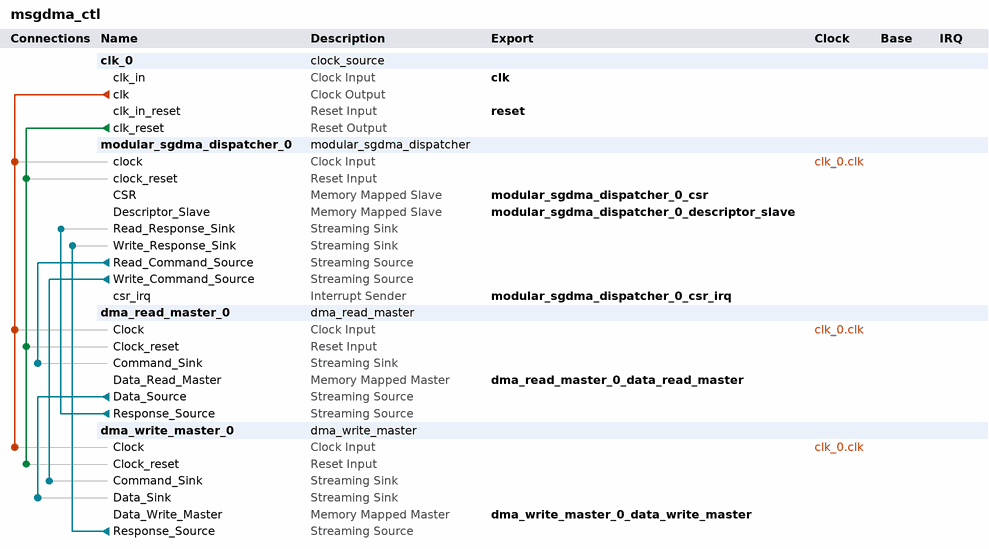
[diagram p0: system contents]
# Platform Designer (Qsys) system msgdma_ctl, Cyclone V 5CGXFC9D6F27C7
# Parameters at their usual value, and those the tool derives, are not listed.
package require -exact qsys 18.1
create_system msgdma_ctl
set_project_property DEVICE_FAMILY {Cyclone V}
set_project_property DEVICE 5CGXFC9D6F27C7

add_instance clk_0 clock_source 18.1
set_instance_parameter_value clk_0 clockFrequency 250000000

add_instance modular_sgdma_dispatcher_0 modular_sgdma_dispatcher 18.1
set_instance_parameter_value modular_sgdma_dispatcher_0 BURST_ENABLE 0
set_instance_parameter_value modular_sgdma_dispatcher_0 BURST_WRAPPING_SUPPORT 0
set_instance_parameter_value modular_sgdma_dispatcher_0 CSR_ADDRESS_WIDTH 3
set_instance_parameter_value modular_sgdma_dispatcher_0 DATA_FIFO_DEPTH 32
set_instance_parameter_value modular_sgdma_dispatcher_0 DATA_WIDTH 32
set_instance_parameter_value modular_sgdma_dispatcher_0 DESCRIPTOR_FIFO_DEPTH 64
set_instance_parameter_value modular_sgdma_dispatcher_0 ENHANCED_FEATURES 0
set_instance_parameter_value modular_sgdma_dispatcher_0 GUI_RESPONSE_PORT 2
set_instance_parameter_value modular_sgdma_dispatcher_0 MAX_BURST_COUNT 2
set_instance_parameter_value modular_sgdma_dispatcher_0 MAX_BYTE 1024
set_instance_parameter_value modular_sgdma_dispatcher_0 MAX_STRIDE 1
set_instance_parameter_value modular_sgdma_dispatcher_0 MODE 0
set_instance_parameter_value modular_sgdma_dispatcher_0 PREFETCHER_USE_CASE 0
set_instance_parameter_value modular_sgdma_dispatcher_0 PROGRAMMABLE_BURST_ENABLE 0
set_instance_parameter_value modular_sgdma_dispatcher_0 STRIDE_ENABLE 0
set_instance_parameter_value modular_sgdma_dispatcher_0 TRANSFER_TYPE {Aligned Accesses}

add_instance dma_read_master_0 dma_read_master 18.1
set_instance_parameter_value dma_read_master_0 BURST_ENABLE 1
set_instance_parameter_value dma_read_master_0 CHANNEL_ENABLE 0
set_instance_parameter_value dma_read_master_0 CHANNEL_WIDTH 8
set_instance_parameter_value dma_read_master_0 DATA_WIDTH 128
set_instance_parameter_value dma_read_master_0 ERROR_ENABLE 0
set_instance_parameter_value dma_read_master_0 ERROR_WIDTH 8
set_instance_parameter_value dma_read_master_0 FIFO_DEPTH 256
set_instance_parameter_value dma_read_master_0 FIFO_SPEED_OPTIMIZATION 1
set_instance_parameter_value dma_read_master_0 FIX_ADDRESS_WIDTH 32
set_instance_parameter_value dma_read_master_0 GUI_BURST_WRAPPING_SUPPORT 0
set_instance_parameter_value dma_read_master_0 GUI_MAX_BURST_COUNT 64
set_instance_parameter_value dma_read_master_0 GUI_PROGRAMMABLE_BURST_ENABLE 0
set_instance_parameter_value dma_read_master_0 GUI_STRIDE_WIDTH 1
set_instance_parameter_value dma_read_master_0 LENGTH_WIDTH 19
set_instance_parameter_value dma_read_master_0 PACKET_ENABLE 0
set_instance_parameter_value dma_read_master_0 STRIDE_ENABLE 0
set_instance_parameter_value dma_read_master_0 TRANSFER_TYPE {Full Word Accesses Only}
set_instance_parameter_value dma_read_master_0 USE_FIX_ADDRESS_WIDTH 0

add_instance dma_write_master_0 dma_write_master 18.1
set_instance_parameter_value dma_write_master_0 BURST_ENABLE 1
set_instance_parameter_value dma_write_master_0 DATA_WIDTH 128
set_instance_parameter_value dma_write_master_0 ERROR_ENABLE 0
set_instance_parameter_value dma_write_master_0 ERROR_WIDTH 8
set_instance_parameter_value dma_write_master_0 FIFO_DEPTH 512
set_instance_parameter_value dma_write_master_0 FIFO_SPEED_OPTIMIZATION 1
set_instance_parameter_value dma_write_master_0 FIX_ADDRESS_WIDTH 32
set_instance_parameter_value dma_write_master_0 GUI_BURST_WRAPPING_SUPPORT 0
set_instance_parameter_value dma_write_master_0 GUI_MAX_BURST_COUNT 128
set_instance_parameter_value dma_write_master_0 GUI_PROGRAMMABLE_BURST_ENABLE 0
set_instance_parameter_value dma_write_master_0 GUI_STRIDE_WIDTH 1
set_instance_parameter_value dma_write_master_0 LENGTH_WIDTH 19
set_instance_parameter_value dma_write_master_0 PACKET_ENABLE 0
set_instance_parameter_value dma_write_master_0 STRIDE_ENABLE 0
set_instance_parameter_value dma_write_master_0 TRANSFER_TYPE {Full Word Accesses Only}
set_instance_parameter_value dma_write_master_0 USE_FIX_ADDRESS_WIDTH 0

# connections
add_connection clk_0.clk dma_read_master_0.Clock clock
add_connection clk_0.clk dma_write_master_0.Clock clock
add_connection clk_0.clk modular_sgdma_dispatcher_0.clock clock
add_connection clk_0.clk_reset dma_read_master_0.Clock_reset reset
add_connection clk_0.clk_reset dma_write_master_0.Clock_reset reset
add_connection clk_0.clk_reset modular_sgdma_dispatcher_0.clock_reset reset
add_connection dma_read_master_0.Data_Source dma_write_master_0.Data_Sink avalon_streaming
add_connection dma_read_master_0.Response_Source modular_sgdma_dispatcher_0.Read_Response_Sink avalon_streaming
add_connection dma_write_master_0.Response_Source modular_sgdma_dispatcher_0.Write_Response_Sink avalon_streaming
add_connection modular_sgdma_dispatcher_0.Read_Command_Source dma_read_master_0.Command_Sink avalon_streaming
add_connection modular_sgdma_dispatcher_0.Write_Command_Source dma_write_master_0.Command_Sink avalon_streaming

# exported interfaces
add_interface clk clock sink
set_interface_property clk EXPORT_OF clk_0.clk_in
add_interface dma_read_master_0_data_read_master avalon master
set_interface_property dma_read_master_0_data_read_master EXPORT_OF dma_read_master_0.Data_Read_Master
add_interface dma_write_master_0_data_write_master avalon master
set_interface_property dma_write_master_0_data_write_master EXPORT_OF dma_write_master_0.Data_Write_Master
add_interface modular_sgdma_dispatcher_0_csr avalon slave
set_interface_property modular_sgdma_dispatcher_0_csr EXPORT_OF modular_sgdma_dispatcher_0.CSR
add_interface modular_sgdma_dispatcher_0_csr_irq interrupt sender
set_interface_property modular_sgdma_dispatcher_0_csr_irq EXPORT_OF modular_sgdma_dispatcher_0.csr_irq
add_interface modular_sgdma_dispatcher_0_descriptor_slave avalon slave
set_interface_property modular_sgdma_dispatcher_0_descriptor_slave EXPORT_OF modular_sgdma_dispatcher_0.Descriptor_Slave
add_interface reset reset sink
set_interface_property reset EXPORT_OF clk_0.clk_in_reset

set_interconnect_requirement {$system} qsys_mm.clockCrossingAdapter AUTO
set_interconnect_requirement {$system} qsys_mm.maxAdditionalLatency 4

save_system msgdma_ctl.qsys
